# EAGLE design spectrum_analyzer (EAGLE 6.6.0)
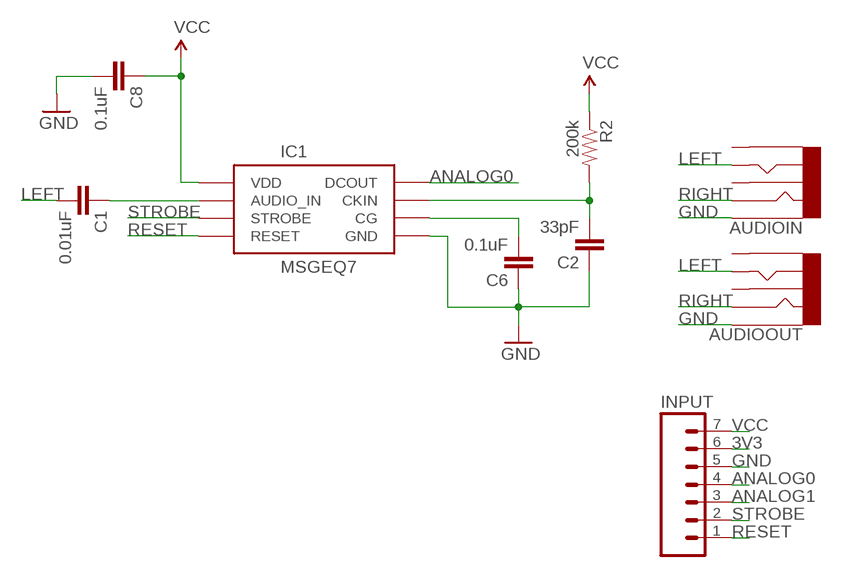
[diagram p0: schematic, sheet 1]

## Parts
AUDIOIN  AUDIO-JACK2  [AUDIO-JACK]
AUDIOOUT  AUDIO-JACK2  [AUDIO-JACK]
C1  0.01uF  CAP0603-CAP  [0603-CAP]
C2  33pF  CAP0603-CAP  [0603-CAP]
C6  0.1uF  CAP0603-CAP  [0603-CAP]
C8  0.1uF  CAP0603-CAP  [0603-CAP]
IC1  MSGEQ7DIL  [DIL-08]
INPUT  M07  [1X07]
R2  200k  RESISTOR0603  [0603-RES]

## Nets
3V3: INPUT.6
ANALOG0: IC1.3(DCOUT) INPUT.4
ANALOG1: INPUT.3
CKIN: C2.2 IC1.8(CKIN) R2.2
GND: AUDIOIN.1 AUDIOOUT.1 C2.1 C6.1 C8.2 IC1.2(GND) INPUT.5
LEFT: AUDIOIN.5 AUDIOOUT.5 C1.2
N$1: C1.1 IC1.5(AUDIO_IN)
N$6: C6.2 IC1.6(CG)
RESET: IC1.7(RESET) INPUT.1
RIGHT: AUDIOIN.2 AUDIOOUT.2
STROBE: IC1.4(STROBE) INPUT.2
VCC: C8.1 IC1.1(VDD) INPUT.7 R2.1
Unconnected: AUDIOIN.3 AUDIOIN.4 AUDIOOUT.3 AUDIOOUT.4

## Library data of the parts
AUDIOIN AUDIOOUT = SparkFun:AUDIO-JACK2
C1 C2 C6 C8 = SparkFun-Capacitors:CAP: Capacitor Standard 0603 ceramic capacitor, and 0.1" leaded capacitor.
IC1 = SparkFun-AnalogIC:MSGEQ7: 7-band graphic equalizer
INPUT = SparkFun-Connectors:M07: Header 7 Standard 7-pin 0.1" header. Use with straight break away headers (SKU : PRT-00116), right angle break away headers (PRT-00553), swiss pins (PRT-00743), machine pins (PRT-00117), and female headers (PRT-00115). NOTES ON THE VARIANTS LOCK and LOCK_LONGPADS... This footprint was designed to help hold the alignment of a through-hole component (i.e. 7-pin header) while soldering it into place. You may notice that each hole has been shifted either up or down by 0.005 of an inch from it's more standard position (which is usually a perfectly straight line). This slight alteration caused the pins (the squares in the middle) to touch the edges of the holes. Because they are alternating, it causes a "brace" to hold the header in place. 0.005 has proven to be the perfect amount of "off-center" position when using our standard breakaway headers. Although looks a little odd when you look at the bare footprint, once you have a header in there, the alteration is very hard to notice. Also, if you push a header all the way into place, it is covered up entirely on the bottom side. This idea of altering the position of holes to aid alignment will be further integrated into the Sparkfun Library for other footprints. It can help hold any component with 3 or more connection pins.
R2 = SparkFun-Resistors:RESISTOR: Resistor Basic schematic elements and footprints for 0603, 1206, and PTH resistors.

## Board
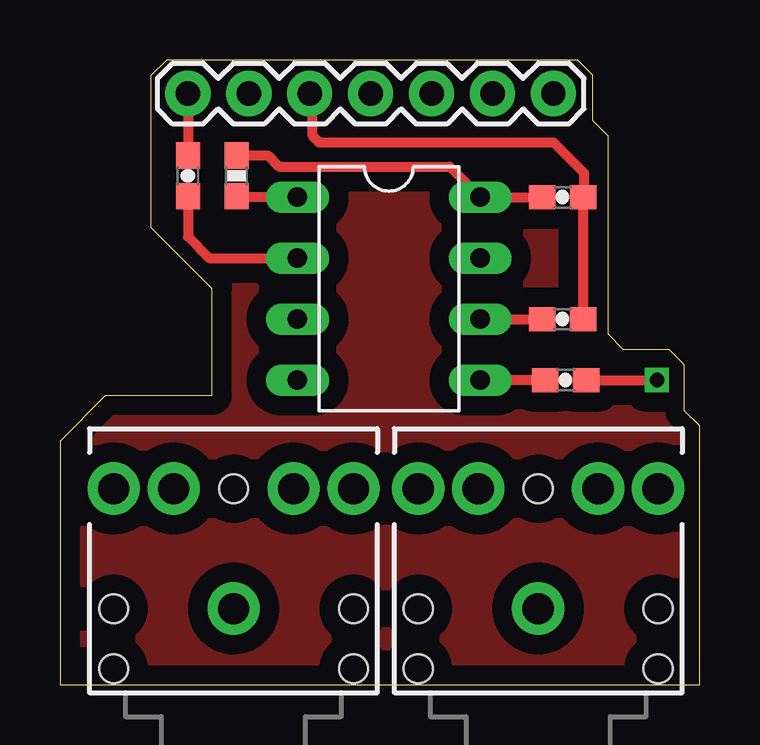
[diagram p1: board, top side]
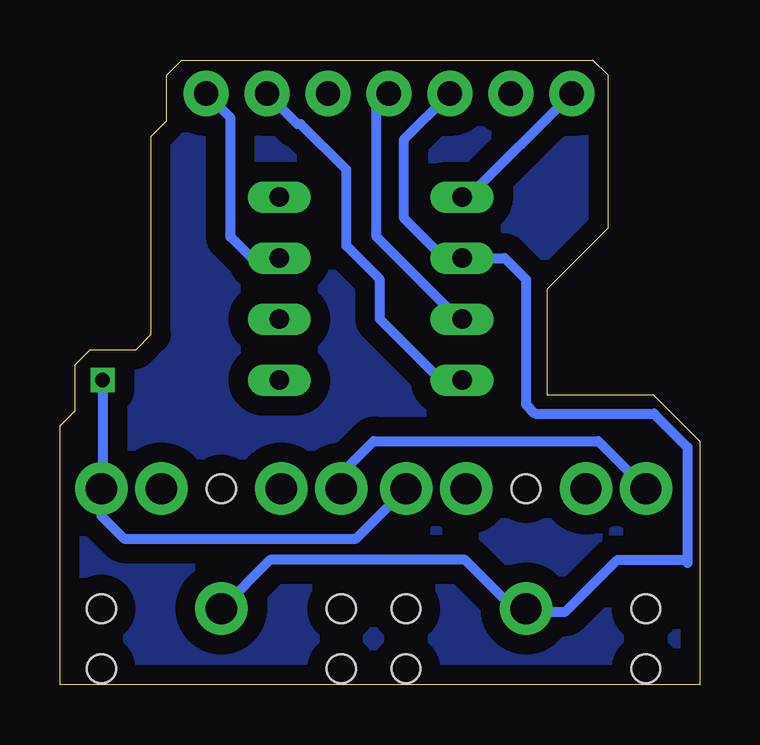
[diagram p2: board, bottom side, seen from below]

Size 26.67 x 26.04 mm. Coordinates in mm from the lower left corner, seen from the top.
Outline: 0,0 26.67,0 26.67,10.79 26.04,11.43 26.04,13.33 25.4,13.97 23.5,13.97 22.86,14.6 22.86,22.86 22.22,23.5 22.22,25.4 21.59,26.04 4.45,26.04 3.81,25.4 3.81,19.05 6.35,16.51 6.35,12.06 1.91,12.06 0,10.16 0,0
Copper layers (1*16): Top 0.035559375mm / dielectric 1.501140625mm / Bottom 0.035559375mm
Design rules "lpkf-strict": minimum track width 4mil, minimum drill 0.39878125mm, track to track 4mil, track to pad 4mil, pad to pad 4mil, via to via 8mil, smd to smd 4mil, copper to edge 8mil, drill to drill 8mil, minimum pad ring 10mil, minimum via ring 8mil, stop-mask expansion 4mil, vias tented up to drill 0mil, thermal gap 10mil

### Footprints (pad centres in the part's own frame; a part is rotated, then mirrored left to right if it is on the bottom)
AUDIO-JACK = drill 1.3 pad 2.184: 1 0,0; 2 5,5; 3 5,2.5; 4 5,-2.5; 5 5,-5 | hole 1.2: 0,5; -2.5,5; -2.5,-5; 0,-5; 5,0
0603-CAP = smd 1.1 x 1: 1 -0.85,0; 2 0.85,0
DIL-08 = drill 0.813 long: 1 -3.81,-3.81; 2 -1.27,-3.81; 3 1.27,-3.81; 4 3.81,-3.81; 5 3.81,3.81; 6 1.27,3.81; 7 -1.27,3.81; 8 -3.81,3.81
1X07 = drill 1.016 pad 1.88: 1 0,0; 2 2.54,0; 3 5.08,0; 4 7.62,0; 5 10.16,0; 6 12.7,0; 7 15.24,0
0603-RES = smd 1.1 x 1: 1 -0.85,0; 2 0.85,0

### Placement (x,y rotation side)
AUDIOIN  7.24,3.18 90 top
AUDIOOUT  19.94,3.18 90 top
C1  21.08,12.7 0 top
C2  20.95,20.32 180 top
C6  20.95,15.24 180 top
C8  5.33,21.21 270 top
IC1  13.72,16.51 270 top
INPUT  20.57,24.64 180 top
R2  7.37,21.21 90 top

### Tracks (layer width: path | path; a pad name or v marks a point on that pad's centre or on a via)
ANALOG0
  Bottom 0.406: IC1.3 10.03,15.24 13.46,18.67 13.46,24.13 INPUT.4
CKIN
  Top 0.406: C2.2 IC1.8 16.26,21.59 9.14,21.59 8.68,22.06 R2.2
GND
  Top 0.406: C8.2 5.33,18.67 6.22,17.78 IC1.2 | C6.1 C2.1 21.84,20.36 21.84,21.34 20.57,22.61 10.8,22.61 10.54,22.86 10.54,24.51 INPUT.5
  Bottom 0.406: AUDIOOUT.1 17.91,5.21 9.78,5.21 7.75,3.18 AUDIOIN.1 7.11,3.05 5.59,3.05 3.43,5.21 0.64,5.21 0.51,5.08 0.51,9.91 1.91,11.3 6.86,11.3 7.24,11.68 7.24,16.89 8.13,17.78 IC1.2 10.67,17.78 12.32,19.43 12.32,22.73 INPUT.5
LEFT  (via drill 0.6)
  Top 0.406: C1.2 v24.89,12.7
  Bottom 0.406: AUDIOIN.5 14.32,6.1 24,6.1 24.94,7.03 AUDIOOUT.5 24.89,8.22 v24.89,12.7
N$1
  Top 0.406: C1.1 IC1.5
N$2
  pour Bottom (isolate 0.813): 0,0.13 26.54,0 26.54,10.92 26.04,11.43 26.04,13.59 25.65,13.97 23.5,13.97 22.86,14.6 22.86,23.11 22.35,23.62 22.35,25.27 21.59,26.04 4.57,26.04 3.94,25.4 3.94,18.8 4.06,18.8 6.48,16.38 6.48,11.94 1.78,11.94 0,10.16 0,7.37 -0.13,7.24
N$3
  pour Top (isolate 0.813): 26.67,10.79 26.54,10.79 26.04,11.3 26.04,13.46 25.65,13.84 23.62,13.84 22.99,14.48 22.99,22.86 22.35,23.5 22.35,25.27 21.59,26.04 4.45,26.04 3.94,25.53 3.94,18.92 6.35,16.51 6.35,12.32 6.48,12.19 2.16,12.19 0,10.03 0,0.13 0.13,0 26.67,0
N$6
  Top 0.406: IC1.6 C6.2
RESET
  Bottom 0.406: IC1.7 18.67,17.78 19.56,18.67 19.56,23.62 INPUT.1
RIGHT
  Bottom 0.406: AUDIOOUT.2 14.94,8.81 13.59,10.16 4.22,10.16 AUDIOIN.2
STROBE
  Bottom 0.406: IC1.4 10.8,12.7 13.34,15.24 13.34,16.89 14.73,18.29 14.73,21.46 16.64,23.37 16.76,23.37 INPUT.2
VCC
  Top 0.406: IC1.1 7.41,20.32 R2.1 | INPUT.7 C8.1
  Bottom 0.406: IC1.1 9.65,20.32 INPUT.7